# Altium schematic sheet AFE_Breakout.SchDoc
size A4
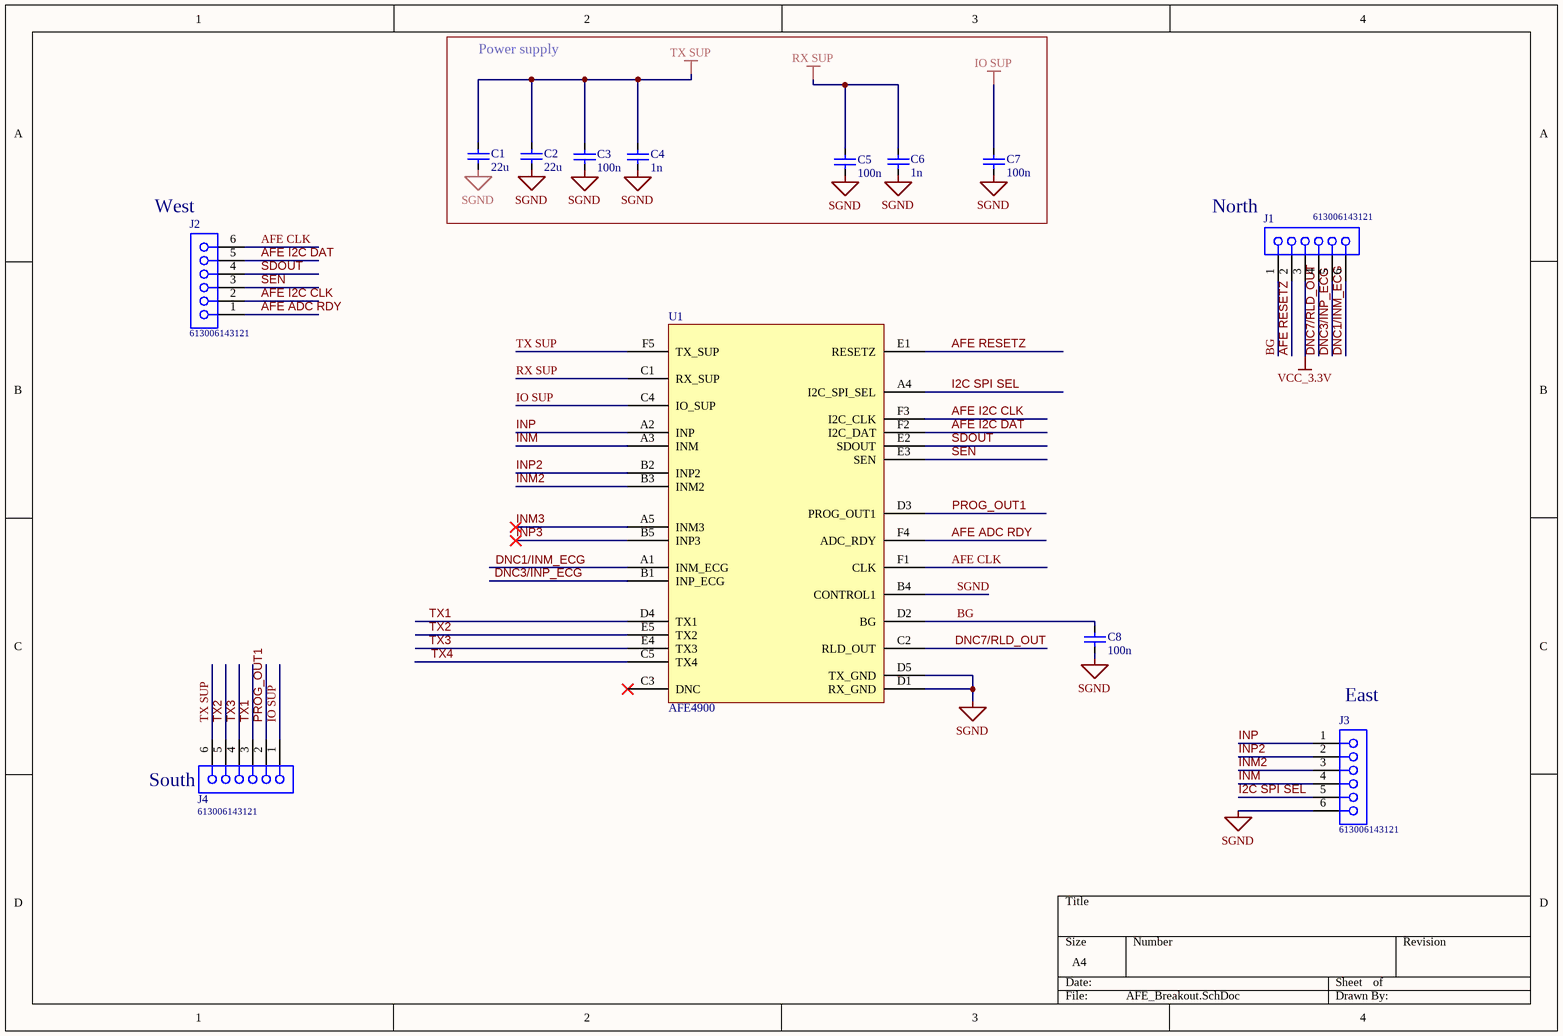
[diagram p0: AFE_Breakout.SchDoc]

## Parts
C1  22u  [CAPC1005X03N]
C2  22u  [CAPC1005X03N]
C3  100n  [CAPC1005X03N]
C4  1n  [CAPC1005X03N]
C5  100n  [CAPC1005X03N]
C6  1n  [CAPC1005X03N]
C7  100n  [CAPC1005X03N]
C8  100n  [CAPC1005X03N]
J1  613006143121  [SLM-106-01-G-S]
J2  613006143121  [SLM-106-01-G-S]
J3  613006143121  [SLM-106-01-G-S]
J4  613006143121  [SLM-106-01-G-S]
U1  AFE4900  [AFE4900_BGA_BreakoutFootprint]

## Blocks framed on the sheet
Power supply: C1-C7

## Nets
IO SUP: C7.2 J4.1 U1.C4(IO_SUP)
RX SUP: C5.2 C6.2 U1.C1(RX_SUP)
SGND: C1.1 C2.1 C3.1 C4.1 C5.1 C6.1 C7.1 C8.1 J3.6 U1.B4(CONTROL1) U1.D1(RX_GND) U1.D5(TX_GND)
TX SUP: C1.2 C2.2 C3.2 C4.2 J4.6 U1.F5(TX_SUP)
VCC_3.3V: J1.3
AFE ADC RDY: J2.1 U1.F4(ADC_RDY)
AFE CLK: J2.6 U1.F1(CLK)
AFE I2C CLK: J2.2 U1.F3(I2C_CLK)
AFE I2C DAT: J2.5 U1.F2(I2C_DAT)
AFE RESETZ: J1.2 U1.E1(RESETZ)
BG: C8.2 J1.1 U1.D2(BG)
DNC1/INM_ECG: J1.6 U1.A1(INM_ECG)
DNC3/INP_ECG: J1.5 U1.B1(INP_ECG)
DNC7/RLD_OUT: J1.4 U1.C2(RLD_OUT)
I2C SPI SEL: J3.5 U1.A4(I2C_SPI_SEL)
INM: J3.4 U1.A3(INM)
INM2: J3.3 U1.B3(INM2)
INM3: U1.A5(INM3)
INP: J3.1 U1.A2(INP)
INP2: J3.2 U1.B2(INP2)
INP3: U1.B5(INP3)
PROG_OUT1: J4.2 U1.D3(PROG_OUT1)
SDOUT: J2.4 U1.E2(SDOUT)
SEN: J2.3 U1.E3(SEN)
TX1: J4.3 U1.D4(TX1)
TX2: J4.5 U1.E5(TX2)
TX3: J4.4 U1.E4(TX3)
TX4: U1.C5(TX4)

Not connected (* = marked no-connect by the designer): U1 C3(DNC)*

## Notes on the sheet
- (near J2) West
- (near J1) North
- (near J3) East
- (near J4) South

## Library data of the parts
C1 C2 = C_0402: Kondensator 0402; Tested: False
C3 C5 C7 C8 = C_100n_50V_0402: Kondensator 100n 50V 0402; Tested: False; Supplier 1: Farnell; Supplier Part Number 1: 2210822
C4 C6 = C_1n_50V_0402: Kondensator 1n 50V 0402; Tested: False; Supplier 1: Digikey; Supplier Part Number 1: 399-10034-1-ND
J1-J4 = 613006143121: THT Angled Socket Header WR-PHD, Pitch 2.54 mm, Single Row, 6 pins; Pin Number: 6; Pitch: 2.54 mm; Gender: Female; Rated Current: 3 A; Working Voltage: 250 VAC; Withstanding Voltage: 500 VAC; Contact Resistance: 20 mOhm; ComponentLink1Description: Manufacturer; ComponentLink1URL: http://www.we-online.de; ComponentLink2Description: Datasheet; ComponentLink2URL: https://katalog.we-online.de/em/datasheet/6130xx143121.pdf; Part Number: 613006143121; Published Date: August 2018; Publisher: Wurth Elektronik; Operating Temperature: -40 to 125 degC; Mounting Technology: THT; Packaging: Tray; Row Number: Single; Orientation: Angled
U1 = AFE4900: Synchronized_ECG_and_PPG_AFE